# EAGLE schematic coreOne (EAGLE 4.16)
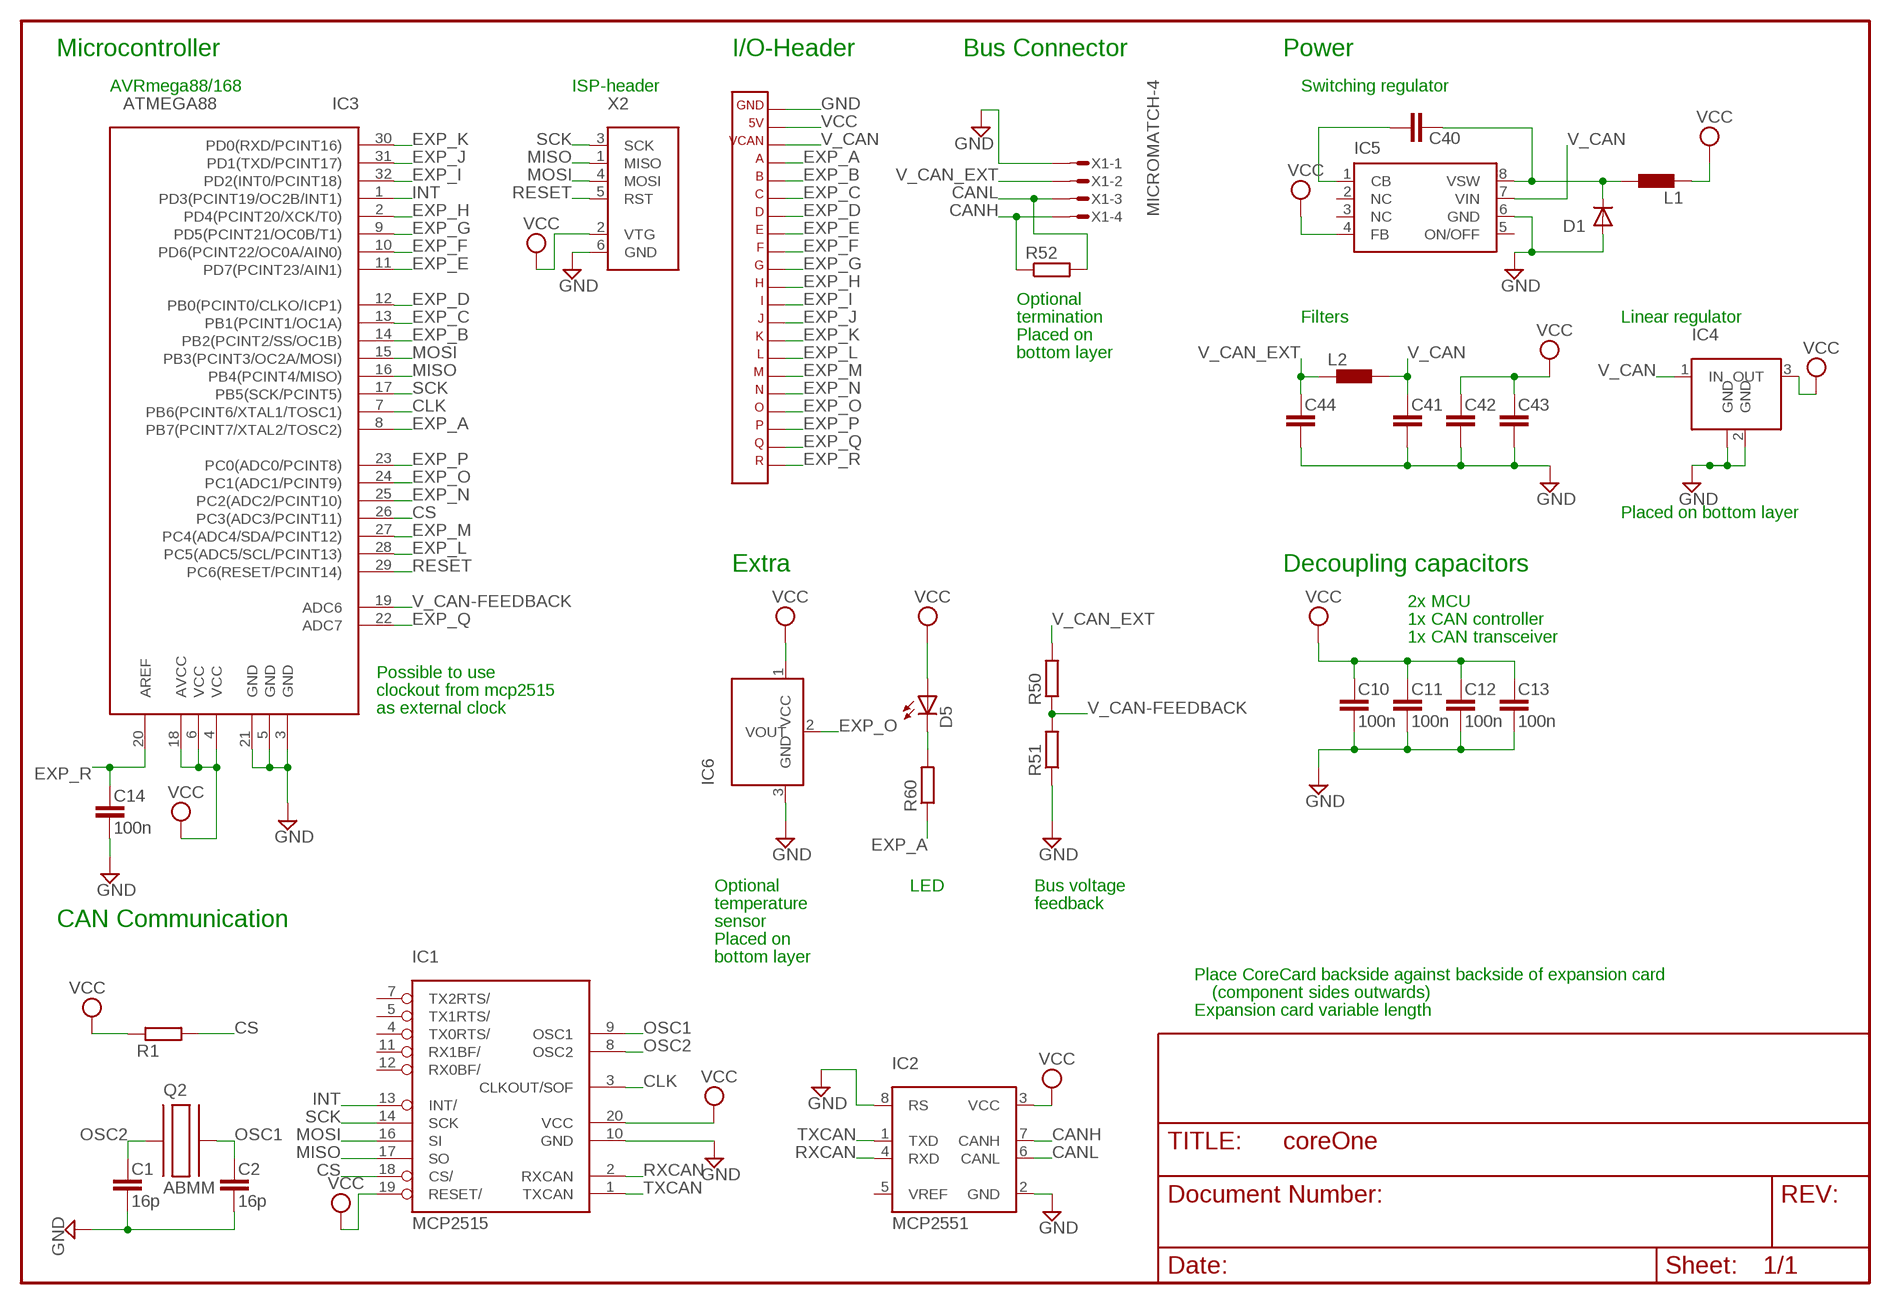
[diagram p0: schematic, sheet 1]

## Parts
C1  16p  C-EUC0603  [C0603]
C2  16p  C-EUC0603  [C0603]
C10  100n  C-EUC0603  [C0603]
C11  100n  C-EUC0603  [C0603]
C12  100n  C-EUC0603  [C0603]
C13  100n  C-EUC0603  [C0603]
C14  100n  C-EUC0603  [C0603]
C40  C-EUC0603  [C0603]
C41  C-EUC1210  [C1210]
C42  C-EUC1210  [C1210]
C43  C-EUC0603  [C0603]
C44  C-EUC0603  [C0603]
D1  DIODESMP  [DO-220AA]
D5  LED  [0603]
IC1  MCP2515  [TSSOP]
IC2  MCP2551  [SOIC]
IC3  ATMEGA88  [TQFP32]
IC4  LM340MP-5.0  [SOT223]
IC5  LM2674  [SO8]
IC6  TC1047A  [SOT23]
L1  L-EUL1812  [L1812]
L2  L-EUL0603  [L0603]
Q2  ABMM  [SMD]
R1  R-EUR0603  [R0603]
R50  R-EUR0603  [R0603]
R51  R-EUR0603  [R0603]
R52  R-EUR0603  [R0603]
R60  R-EUR0603  [R0603]
X1  MICROMATCH-4  [MICROMATCH-4]
X2  AVRISP6PINHEADER  [6PINHEADER]
X3  CORE_IOHEAD  [CORE_IOHEAD]

## Nets
CANH: IC2.7(CANH) R52.1 X1.4
CANL: IC2.6(CANL) R52.2 X1.3
CB: C40.1 IC5.1(CB)
CLK: IC1.3(CLKOUT/SOF) IC3.7(PB6(PCINT6/XTAL1/TOSC1))
CS: IC1.18(CS/) IC3.26(PC3(ADC3/PCINT11)) R1.2
EXP_A: IC3.8(PB7(PCINT7/XTAL2/TOSC2)) R60.1 X3.4
EXP_B: IC3.14(PB2(PCINT2/SS/OC1B)) X3.5
EXP_C: IC3.13(PB1(PCINT1/OC1A)) X3.6
EXP_D: IC3.12(PB0(PCINT0/CLKO/ICP1)) X3.7
EXP_E: IC3.11(PD7(PCINT23/AIN1)) X3.8
EXP_F: IC3.10(PD6(PCINT22/OC0A/AIN0)) X3.9
EXP_G: IC3.9(PD5(PCINT21/OC0B/T1)) X3.10
EXP_H: IC3.2(PD4(PCINT20/XCK/T0)) X3.11
EXP_I: IC3.32(PD2(INT0/PCINT18)) X3.12
EXP_J: IC3.31(PD1(TXD/PCINT17)) X3.13
EXP_K: IC3.30(PD0(RXD/PCINT16)) X3.14
EXP_L: IC3.28(PC5(ADC5/SCL/PCINT13)) X3.15
EXP_M: IC3.27(PC4(ADC4/SDA/PCINT12)) X3.16
EXP_N: IC3.25(PC2(ADC2/PCINT10)) X3.17
EXP_O: IC3.24(PC1(ADC1/PCINT9)) IC6.2(VOUT) X3.18
EXP_P: IC3.23(PC0(ADC0/PCINT8)) X3.19
EXP_Q: IC3.22(ADC7) X3.20
EXP_R: C14.1 IC3.20(AREF) X3.21
GND: C1.2 C2.2 C10.2 C11.2 C12.2 C13.2 C14.2 C41.2 C42.2 C43.2 C44.2 D1.A IC1.10(GND) IC2.2(GND) IC2.8(RS) IC3.3(GND) IC3.5(GND) IC3.21(GND) IC4.2(GND) IC4.4(GND) IC5.6(GND) IC6.3(GND) R51.1 X1.1 X2.6(GND) X3.1
INT: IC1.13(INT/) IC3.1(PD3(PCINT19/OC2B/INT1))
MISO: IC1.17(SO) IC3.16(PB4(PCINT4/MISO)) X2.1(MISO)
MOSI: IC1.16(SI) IC3.15(PB3(PCINT3/OC2A/MOSI)) X2.4(MOSI)
N$2: D5.C R60.2
OSC1: C2.1 IC1.9(OSC1) Q2.2
OSC2: C1.1 IC1.8(OSC2) Q2.1
RESET: IC3.29(PC6(RESET/PCINT14)) X2.5(RST)
RXCAN: IC1.2(RXCAN) IC2.4(RXD)
SCK: IC1.14(SCK) IC3.17(PB5(SCK/PCINT5)) X2.3(SCK)
TXCAN: IC1.1(TXCAN) IC2.1(TXD)
V_CAN: C41.1 IC4.1(IN) IC5.7(VIN) L2.2 X3.3
V_CAN-FEEDBACK: IC3.19(ADC6) R50.1 R51.2
V_CAN_EXT: C44.1 L2.1 R50.2 X1.2
VCC: C10.1 C11.1 C12.1 C13.1 C42.1 C43.1 D5.A IC1.19(RESET/) IC1.20(VCC) IC2.3(VCC) IC3.4(VCC) IC3.6(VCC) IC3.18(AVCC) IC4.3(OUT) IC5.4(FB) IC6.1(VCC) L1.1 R1.1 X2.2(VTG) X3.2
VSW: C40.2 D1.C IC5.8(VSW) L1.2
Unconnected: IC1.4(TX0RTS/) IC1.5(TX1RTS/) IC1.7(TX2RTS/) IC1.11(RX1BF/) IC1.12(RX0BF/) IC2.5(VREF) IC5.2(NC) IC5.3(NC) IC5.5(ON/OFF)

## Notes on the sheet
- Microcontroller | I/O-Header | Bus Connector | Power
- AVRmega88/168 | ISP-header | Switching regulator
- Optional
- termination | Filters | Linear regulator
- Placed on
- bottom layer
- Placed on bottom layer
- Extra | Decoupling capacitors
- 2x MCU
- 1x CAN controller
- 1x CAN transceiver
- Possible to use
- clockout from mcp2515
- as external clock
- Optional | LED | Bus voltage
- temperature | feedback
- CAN Communication | sensor
- Placed on
- bottom layer
- Place CoreCard backside against backside of expansion card
- (component sides outwards)
- Expansion card variable length

## Power pins joined to a net without a drawn wire
GND: Q2.GND@0(GND) Q2.GND@1(GND)

## Library data of the parts
C1 C2 C10-C14 C40-C44 = rcl:C-EU
D1 = diode:DIODE: DIODE ultra fast rectifier, 3 A
D5 = led:LED
IC1 = mcp2515:MCP2515
IC2 = mcp2551:MCP2551
IC3 = atmega88:ATMEGA88
IC4 = lm340mp:LM340MP-5.0
IC5 = lm2674:LM2674
IC6 = tc1047a:TC1047A
L1 L2 = rcl:L-EU
Q2 = abmm:ABMM
R1 R50-R52 R60 = rcl:R-EU
X1 = con-amp-micromatch:MICROMATCH-4: MicroMaTch 4 7-215464-4 / 0-215464-4 Drawing Number C-215464 DDEController.pdf
X2 = avrisp:AVRISP6PIN
X3 = expboard:CORE_IOHEAD: CoreCard IO-header for expansion cards